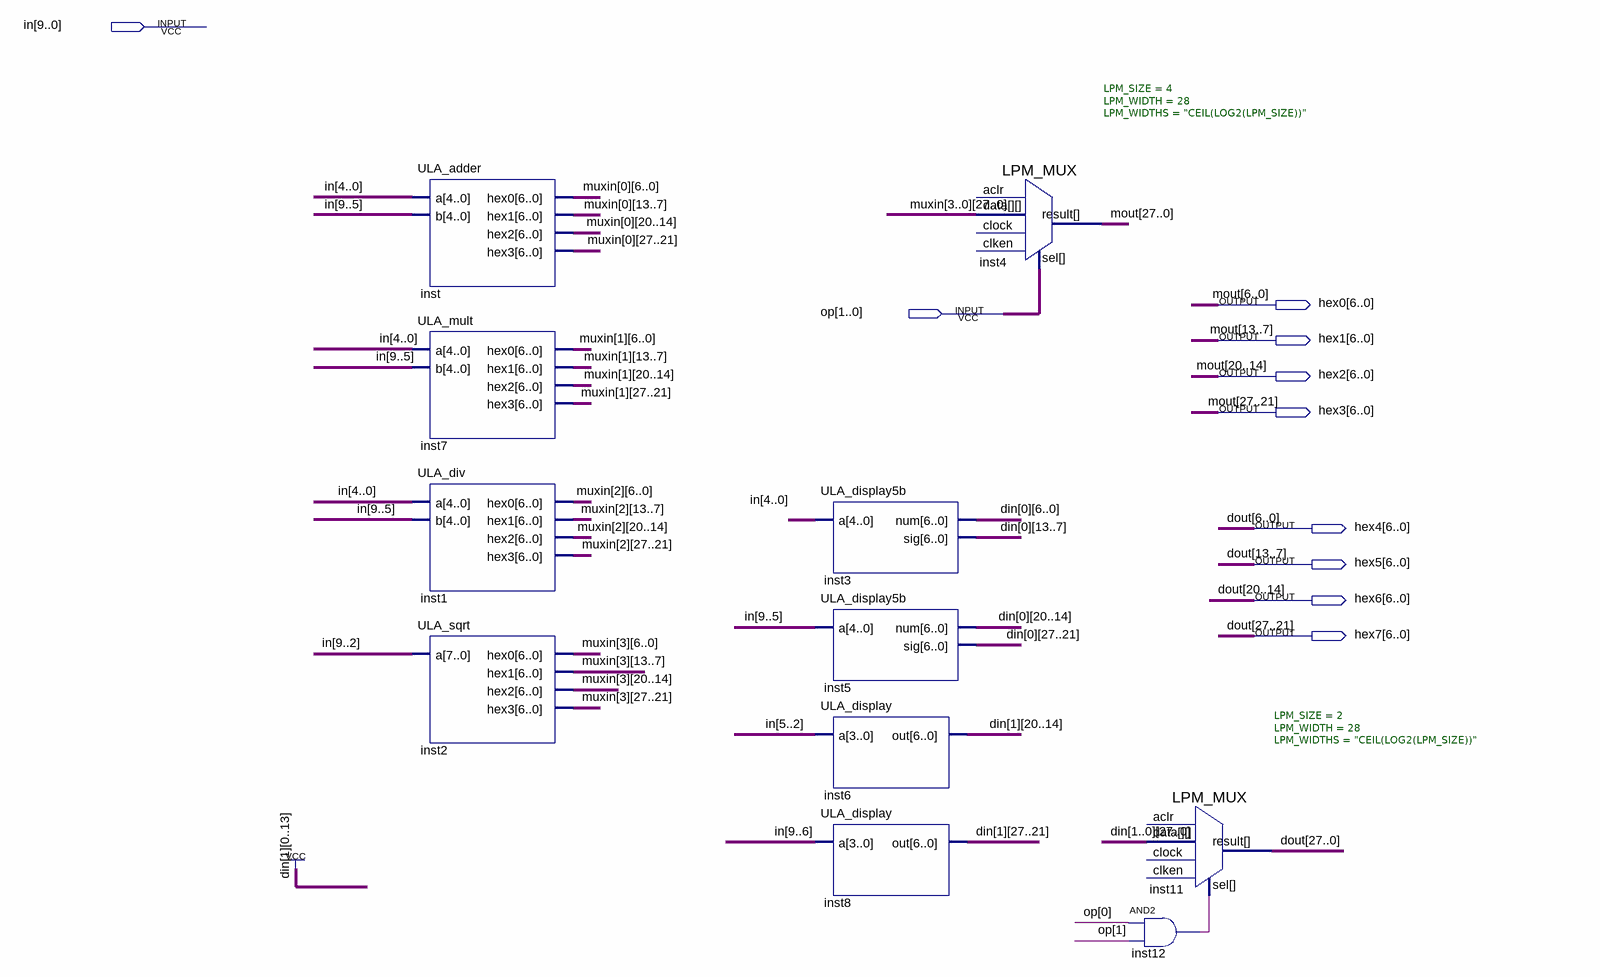
[diagram p0: schematic sheet]
// Quartus schematic ULA.bdf as structural Verilog: 11 symbols, 10 pins
module ULA (
  input  [9:0] in,
  input  [1:0] op,
  output [6:0] hex0,
  output [6:0] hex1,
  output [6:0] hex2,
  output [6:0] hex3,
  output [6:0] hex4,
  output [6:0] hex5,
  output [6:0] hex6,
  output [6:0] hex7
);

  wire inst12_out;
  wire [27:0] din_0, muxin_0, muxin_1, muxin_2, muxin_3;
  wire [27:14] din_1;

  ULA_adder inst (
    .a(in[4:0]), .b(in[9:5]), .hex0(muxin_0[6:0]), .hex1(muxin_0[13:7]), .hex2(muxin_0[20:14]),
    .hex3(muxin_0[27:21]));
  ULA_mult inst7 (
    .a(in[4:0]), .b(in[9:5]), .hex0(muxin_1[6:0]), .hex1(muxin_1[13:7]), .hex2(muxin_1[20:14]),
    .hex3(muxin_1[27:21]));
  ULA_div inst1 (
    .a(in[4:0]), .b(in[9:5]), .hex0(muxin_2[6:0]), .hex1(muxin_2[13:7]), .hex2(muxin_2[20:14]),
    .hex3(muxin_2[27:21]));
  ULA_sqrt inst2 (.a(in[9:2]), .hex0(muxin_3[6:0]), .hex1(muxin_3[13:7]), .hex2(muxin_3[20:14]), .hex3(muxin_3[27:21]));
  ULA_display5b inst3 (.a(in[4:0]), .num(din_0[6:0]), .sig(din_0[13:7]));
  ULA_display5b inst5 (.a(in[9:5]), .num(din_0[20:14]), .sig(din_0[27:21]));
  ULA_display inst6 (.a(in[5:2]), .out(din_1[20:14]));
  ULA_display inst8 (.a(in[9:6]), .out(din_1[27:21]));
  LPM_MUX #(.LPM_SIZE(4), .LPM_WIDTH(28), .LPM_WIDTHS("CEIL(LOG2(LPM_SIZE))")) inst4 (
    .data({muxin_3, muxin_2, muxin_1, muxin_0}), .sel(op), .result({hex3, hex2, hex1, hex0}));  // open: clock, aclr, clken
  and inst12 (inst12_out, op[0], op[1]);
  LPM_MUX #(.LPM_SIZE(2), .LPM_WIDTH(28), .LPM_WIDTHS("CEIL(LOG2(LPM_SIZE))")) inst11 (
    .data({din_1, {14{1'b1}}, din_0}), .sel(inst12_out), .result({hex7, hex6, hex5, hex4}));  // open: clock, aclr, clken

  // Other names for the same wires on the sheet: dout[27:0] = {hex7, hex6, hex5, hex4};
  //   mout[27:0] = {hex3, hex2, hex1, hex0}
endmodule
